# EAGLE design sensor only (EAGLE 7.6.0)
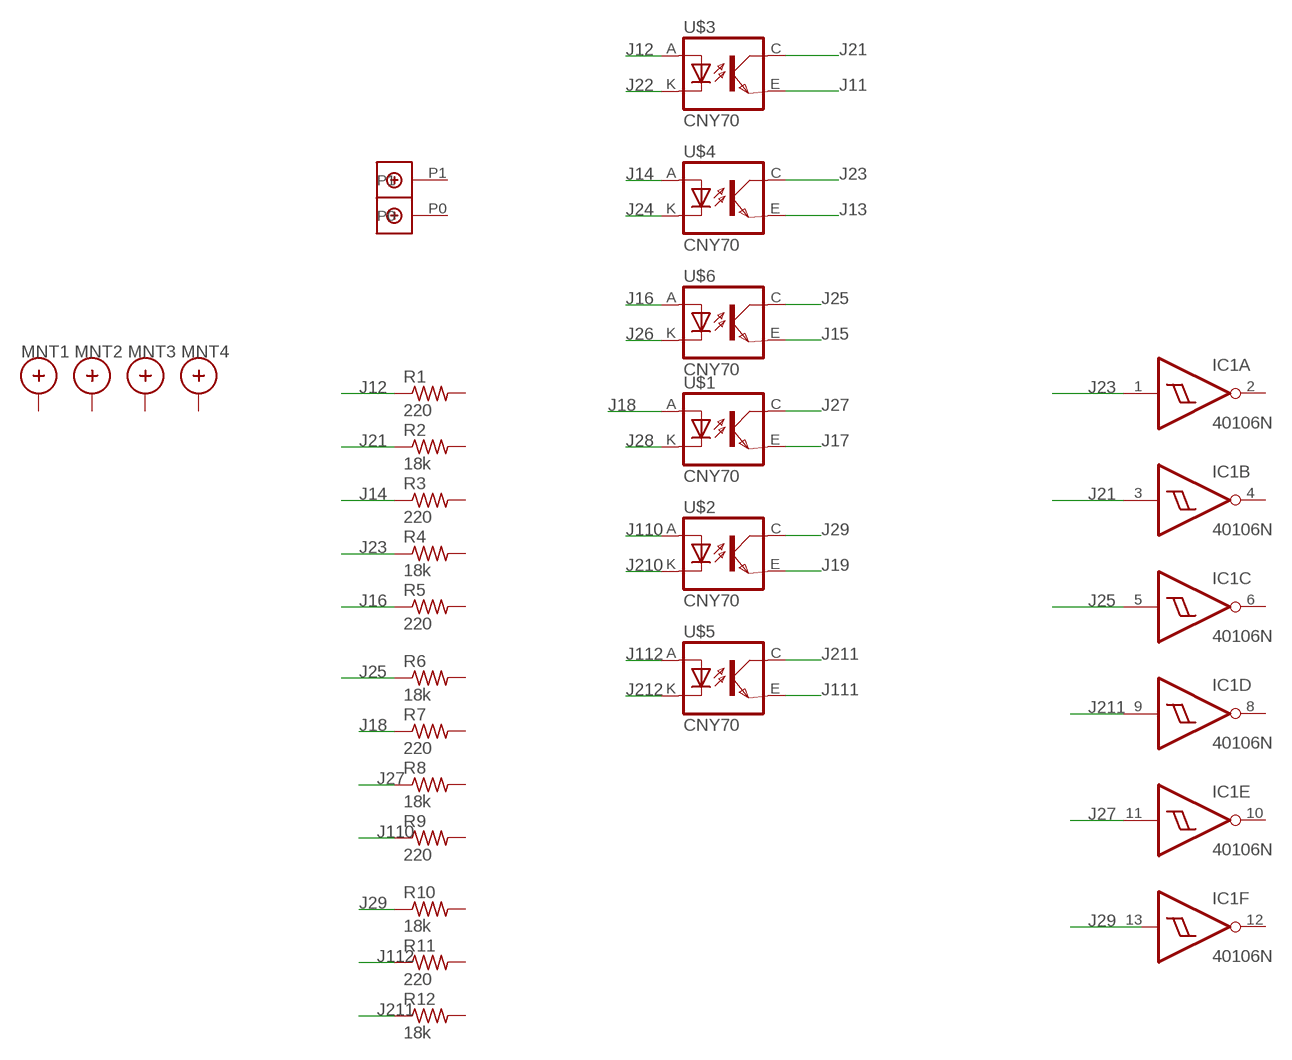
[diagram p0: schematic, sheet 1]

## Parts
IC1  40106N  [DIL14]
MNT1  HOLE_MNT_0.135  [HOLE_MNT_#5-40]
MNT2  HOLE_MNT_0.135  [HOLE_MNT_#5-40]
MNT3  HOLE_MNT_0.135  [HOLE_MNT_#5-40]
MNT4  HOLE_MNT_0.135  [HOLE_MNT_#5-40]
R1  220  R-US_0309/10  [0309/10]
R2  18k  R-US_0309/10  [0309/10]
R3  220  R-US_0309/10  [0309/10]
R4  18k  R-US_0309/10  [0309/10]
R5  220  R-US_0309/10  [0309/10]
R6  18k  R-US_0309/10  [0309/10]
R7  220  R-US_0309/10  [0309/10]
R8  18k  R-US_0309/10  [0309/10]
R9  220  R-US_0309/10  [0309/10]
R10  18k  R-US_0309/10  [0309/10]
R11  220  R-US_0309/10  [0309/10]
R12  18k  R-US_0309/10  [0309/10]
U$1  CNY70  [4]
U$2  CNY70  [4]
U$3  CNY70  [4]
U$4  CNY70  [4]
U$5  CNY70  [4]
U$6  CNY70  [4]
U$7  DBCONN-1X2  [DBCONN-1X2]

## Nets
J11: U$3.E(EMI)
J12: R1.1 U$3.A
J13: U$4.E(EMI)
J14: R3.1 U$4.A
J15: U$6.E(EMI)
J16: R5.1 U$6.A
J17: U$1.E(EMI)
J18: R7.1 U$1.A
J19: U$2.E(EMI)
J21: IC1.3(B:I) R2.1 U$3.C(COL)
J22: U$3.K(C)
J23: IC1.1(A:I) R4.1 U$4.C(COL)
J24: U$4.K(C)
J25: IC1.5(C:I) R6.1 U$6.C(COL)
J26: U$6.K(C)
J27: IC1.11(E:I) R8.1 U$1.C(COL)
J28: U$1.K(C)
J29: R10.1 U$2.C(COL)
J110: R9.1 U$2.A
J111: U$5.E(EMI)
J112: R11.1 U$5.A
J210: U$2.K(C)
J211: IC1.9(D:I) R12.1 U$5.C(COL)
J212: U$5.K(C)
Unconnected: IC1.2(A:O) IC1.4(B:O) IC1.6(C:O) IC1.8(D:O) IC1.10(E:O) IC1.12(F:O) IC1.13(F:I) MNT1.P$1 MNT2.P$1 MNT3.P$1 MNT4.P$1 R1.2 R2.2 R3.2 R4.2 R5.2 R6.2 R7.2 R8.2 R9.2 R10.2 R11.2 R12.2 U$7.P0 U$7.P1

## Power pins joined to a net without a drawn wire
VDD: IC1.14(P:VDD)
VSS: IC1.7(P:VSS)

## Library data of the parts
IC1 = 40xx:40106: Hex SCHMITT TRIGGER
MNT1-MNT4 = Existing Library:HOLE_MNT_0.135: Mounting Hole. 0.135 plated hole created for a #5-40 screw, McMaster p/n 91772A125
R1-R12 = rcl:R-US_: RESISTOR, American symbol
U$1-U$6 = cny70:CNY70
U$7 = Terminal Block Connector:DBCONN-1X2

## Board
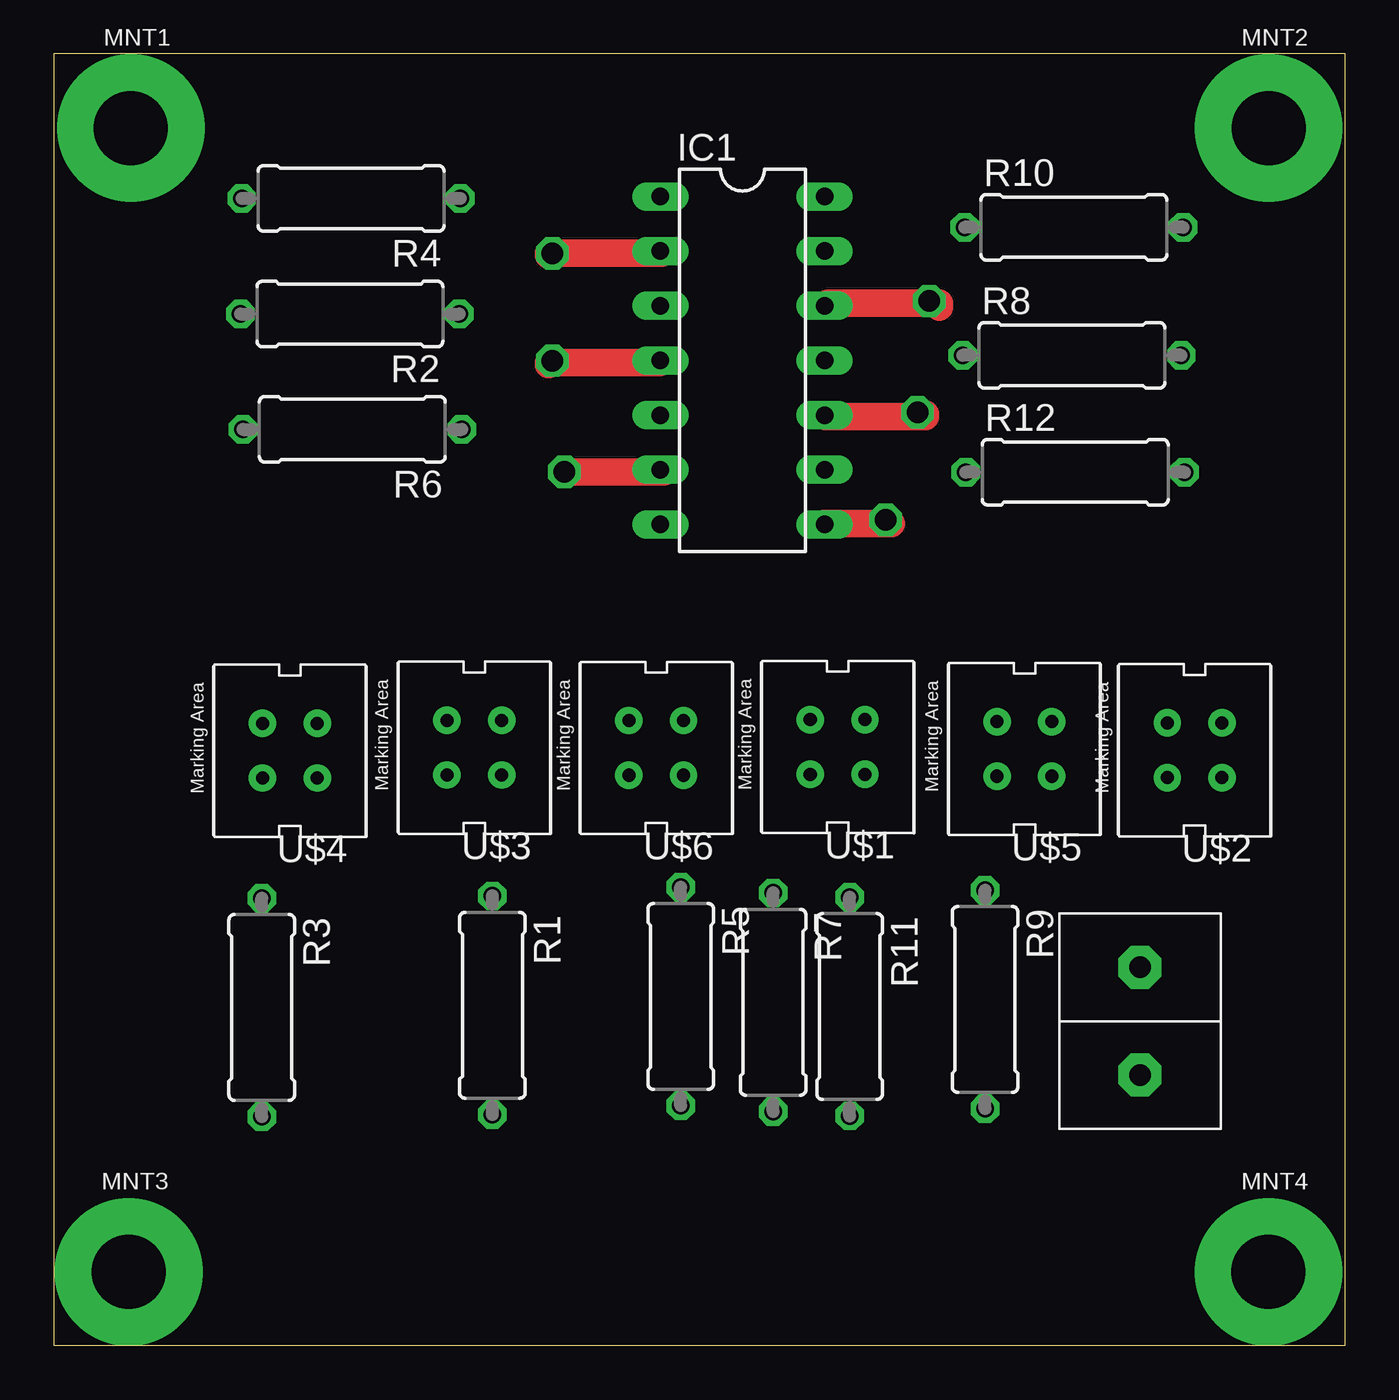
[diagram p1: board, top side]
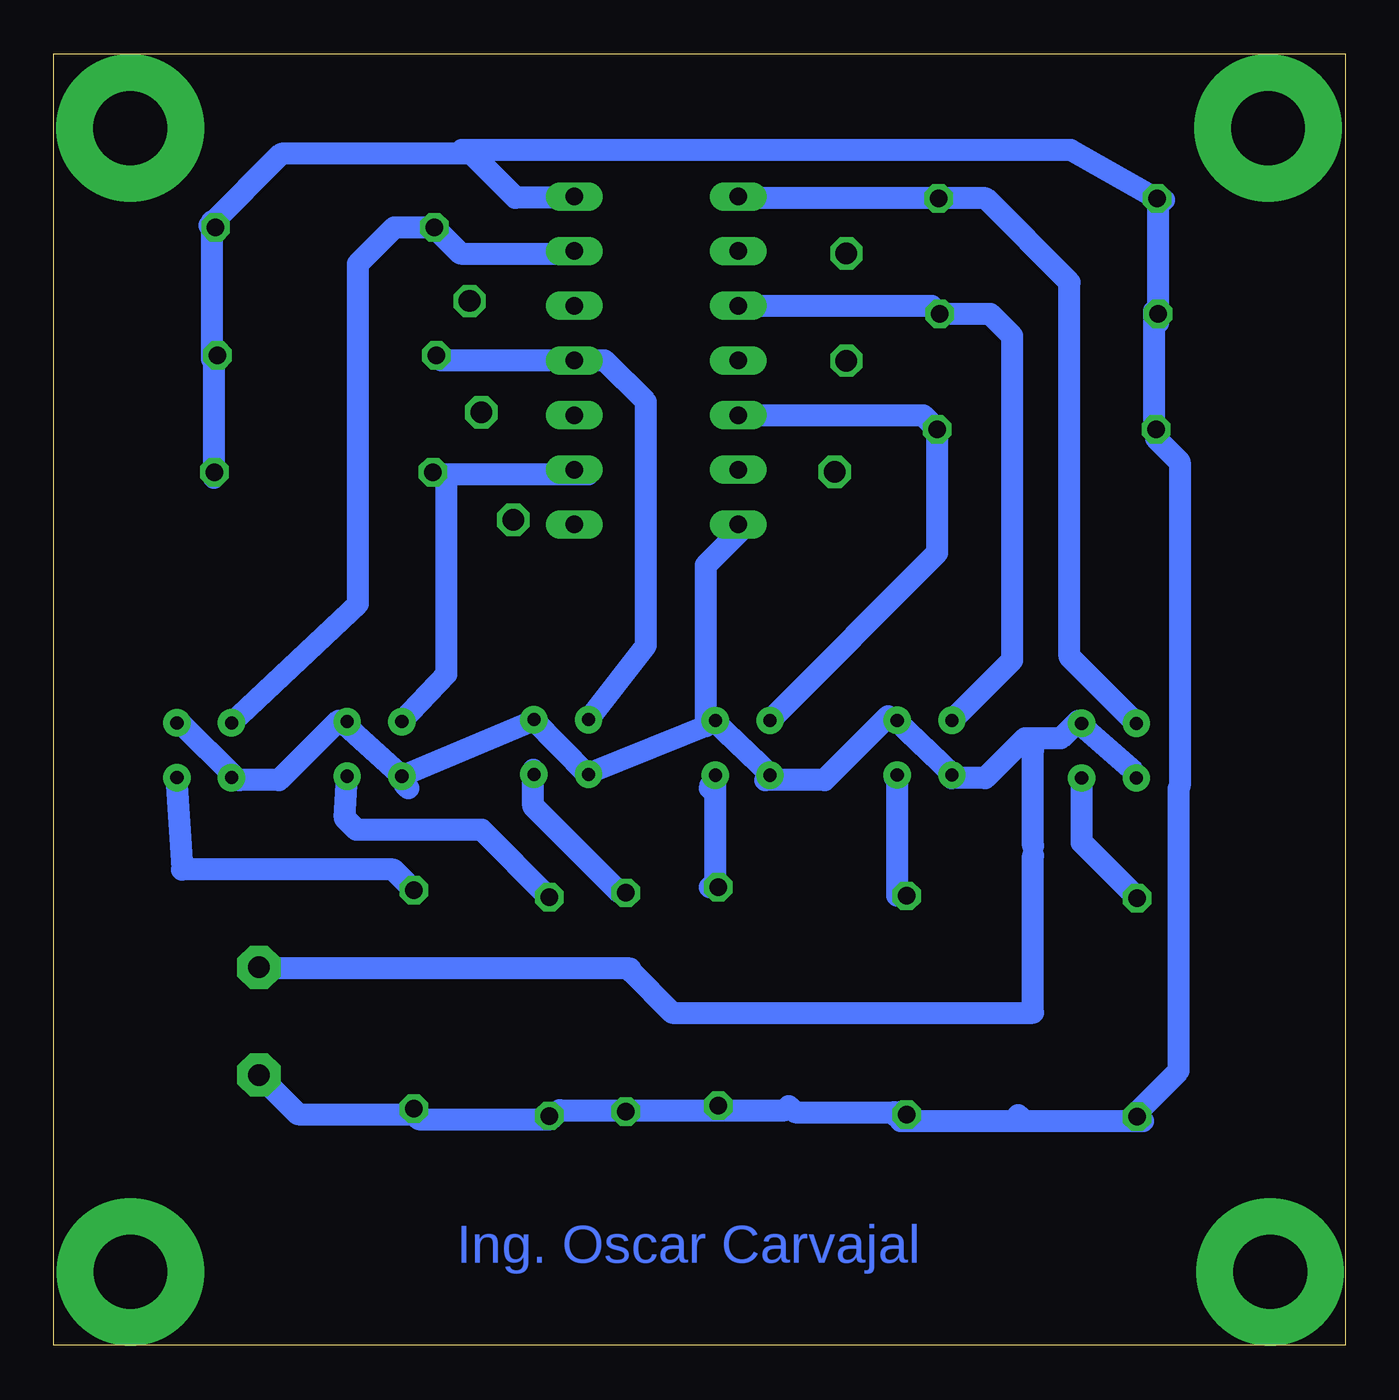
[diagram p2: board, bottom side, seen from below]

Size 60 x 60 mm. Coordinates in mm from the lower left corner, seen from the top.
Outline: 0,0 60,0 60,60 0,60 0,0
Copper layers (1*16): Top 0.035mm / dielectric 1.5mm / Bottom 0.035mm
Design rules "default": minimum track width 10mil, minimum drill 24mil, track to track 8mil, track to pad 8mil, pad to pad 8mil, via to via 8mil, smd to smd 8mil, copper to edge 40mil, drill to drill 8mil, minimum pad ring 10mil, minimum via ring 8mil, stop-mask expansion 4mil, vias tented up to drill 0mil, thermal gap 10mil

### Footprints (pad centres in the part's own frame; a part is rotated, then mirrored left to right if it is on the bottom)
DIL14 = drill 0.813 long: 1 -7.62,-3.81; 2 -5.08,-3.81; 3 -2.54,-3.81; 4 0,-3.81; 5 2.54,-3.81; 6 5.08,-3.81; 7 7.62,-3.81; 8 7.62,3.81; 9 5.08,3.81; 10 2.54,3.81; 11 0,3.81; 12 -2.54,3.81; 13 -5.08,3.81; 14 -7.62,3.81
HOLE_MNT_#5-40 = drill 3.429 pad 6.858: P$1 0,0
0309/10 = drill 0.813 octagon: 1 -5.08,0; 2 5.08,0
4 = drill 0.61 pad 1.27: A -1.27,1.27; C 1.27,-1.27; E 1.27,1.27; K -1.27,-1.27
DBCONN-1X2 = drill 1 pad 2 octagon: P0 -2.54,0; P1 2.46,0

### Placement (x,y rotation side)
IC1  32,45.75 270 top
MNT1  3.58,56.55 0 top
MNT2  56.45,56.55 0 top
MNT3  3.48,3.4 0 top
MNT4  56.44,3.4 0 top
R1  20.38,15.79 270 top
R2  13.76,47.91 180 top
R3  9.66,15.69 270 top
R4  13.81,53.28 180 top
R5  29.13,16.2 270 top
R6  13.87,42.55 180 top
R7  33.42,15.93 270 top
R8  47.31,45.99 0 top
R9  43.27,16.06 270 top
R10  47.4,51.94 0 top
R11  36.98,15.73 270 top
R12  47.46,40.56 0 top
U$1  36.42,27.79 180 top
U$2  53.01,27.64 180 top
U$3  19.54,27.76 180 top
U$4  10.97,27.62 180 top
U$5  45.1,27.7 180 top
U$6  27.99,27.75 180 top
U$7  50.47,15.09 90 top

### Tracks (layer width: path | path; a pad name or v marks a point on that pad's centre or on a via)
J12
  Bottom 1.016: 20.92,26.38 U$3.A 20.81,20.87 R1.1
J14
  Bottom 1.016: R3.1 12.24,23.35 U$4.A
J16
  Bottom 1.016: 29.53,25.88 U$6.A 29.26,21.28 | R5.1 29.26,21.28 | 29.53,21.28 29.26,21.28
J18
  Bottom 1.016: R7.1 33.69,21.01 37.73,25.05 37.73,26.73 U$1.A
J21
  Bottom 1.016: IC1.3 19.22,48.29 R2.1 16.49,47.91 15.47,46.89 15.47,31.83 U$3.C
J23
  Bottom 1.016: IC1.1 28.1,53.28 R4.1 16.7,53.28 12.8,49.38 12.8,31.99 U$4.C
J25
  Bottom 1.016: IC1.5 19.61,43.21 R6.1 18.95,36.82 U$6.C
J27
  Bottom 1.016: R8.1 41.99,45.75 IC1.11 34.41,45.75 32.49,43.83 32.49,32.51 U$1.C
J29
  Bottom 1.016: 36.31,50.72 41.1,50.72 R10.1 44.17,51.94 45.87,50.24 45.87,34.44 U$2.C
J110
  Bottom 1.016: R9.1 44.23,22.1 54.05,22.1 54,22.15 U$2.A
J112
  Bottom 1.016: R11.1 40.11,23.94 45.93,23.94 46.48,24.49 U$5.A
J211
  Bottom 1.016: R12.1 42.29,40.47 41.76,40.47 | 41.76,40.47 35.17,40.47 35.37,40.67 IC1.9 | U$5.C 41.76,31.18 41.76,40.47
N$1
  Bottom 1.016: 8.42,53.22 8.69,53.22 8.69,48.05 | 8.69,48.05 8.69,47.49 | 8.69,48.05 8.88,48.05 8.88,42.41
N$2
  Bottom 1.016: 36.35,53.31 38.55,53.31 40.59,55.35 49.43,55.35 52.76,52.02
N$3
  Bottom 1.016: 52.66,52.21 52.66,45.83 52.48,45.65
N$4
  Bottom 1.016: 52.57,46.11 52.57,40.29
N$5
  Bottom 1.016: 8.51,53.13 12.75,55.53 41.05,55.53
N$6
  Bottom 1.016: 8.79,42.14 7.68,41.03 7.68,25.97
N$7
  Bottom 1.016: 9.8,26.62 12.2,28.75
N$8
  Bottom 1.016: 18.28,26.53 20.86,29.02
N$11
  Bottom 1.016: 43.72,26.34 46.67,29.02
N$12
  Bottom 1.016: 27.96,37.98 29.71,36.23 29.71,28.75
N$13
  Bottom 1.016: 51.65,26.44 54.05,28.84 54.23,28.84
N$14
  Bottom 1.016: 12.38,29.02 13.21,28.19 14.87,28.19 16.72,26.34 18.28,26.34
N$15
  Bottom 1.016: 21.23,29.21 24.19,26.25 26.95,26.25
N$18
  Bottom 1.016: 46.76,29.02 49.53,26.25 51.37,26.25
N$19
  Bottom 1.016: 43.72,26.07 43.53,25.88
N$20
  Bottom 1.016: 33.22,17.5 50.82,17.5
N$21
  Bottom 1.016: 50.45,12.53 48.65,10.73 43.31,10.73 43.31,10.77 43.04,10.5 36.9,10.5 36.49,10.91 26.02,10.91
N$22
  Bottom 1.016: 25.84,11.1 25.56,10.82 20.95,10.82
N$23
  Bottom 1.016: 20.68,10.82 20.73,10.77 21,10.77 20.64,10.41 14.69,10.41
N$24
  Bottom 1.016: 15.19,10.68 14.92,10.41 9.39,10.41
N$25
  Bottom 1.016: 9.52,10.96 7.73,12.75 7.73,25.85
N$26
  Bottom 1.016: 35.84,53.42 35.74,53.32 35.66,53.32
N$27
  Bottom 1.016: 36.03,50.83 35.84,50.83
N$28
  Bottom 1.016: 33.21,17.38 31.27,15.44 14.5,15.44 14.5,22.74
N$29
  Bottom 1.016: 14.5,23.2 14.5,27.64
N$31  (via drill 1)
  Top 1.27: 28.24,50.73 v23.17,50.73 22.98,50.73 22.98,50.64
N$32
  Top 1.27: 35.98,48.42 41.14,48.42 41.14,48.23
N$33
  Top 1.27: 35.89,43.15 40.5,43.15 40.5,43.25
N$34
  Top 1.27: 28.14,45.65 22.98,45.65 22.98,45.56
N$35  (via drill 1)
  Top 1.27: 28.33,40.57 v23.72,40.57 23.72,40.48
N$36  (via drill 1)
  other vias: 23.17,45.74
N$37  (via drill 1)
  other vias: 40.13,43.34
N$38  (via drill 1)
  other vias: 40.68,48.51
N$39
  Top 1.27: 35.79,38.17 38.93,38.17
N$40
  Bottom 1.016: 26.69,26.48 29.33,29
N$41
  Bottom 1.016: 29.21,28.95 35.2,26.54
N$42
  Bottom 1.016: 35.2,26.51 37.72,29.09
N$43
  Bottom 1.016: 37.72,29 43.87,26.43
N$44  (via drill 1)
  other vias: 38.65,38.35

### Text on the board
Bottom: Ing. Oscar Carvajal